# EAGLE schematic plug-board (EAGLE 6.5.0)
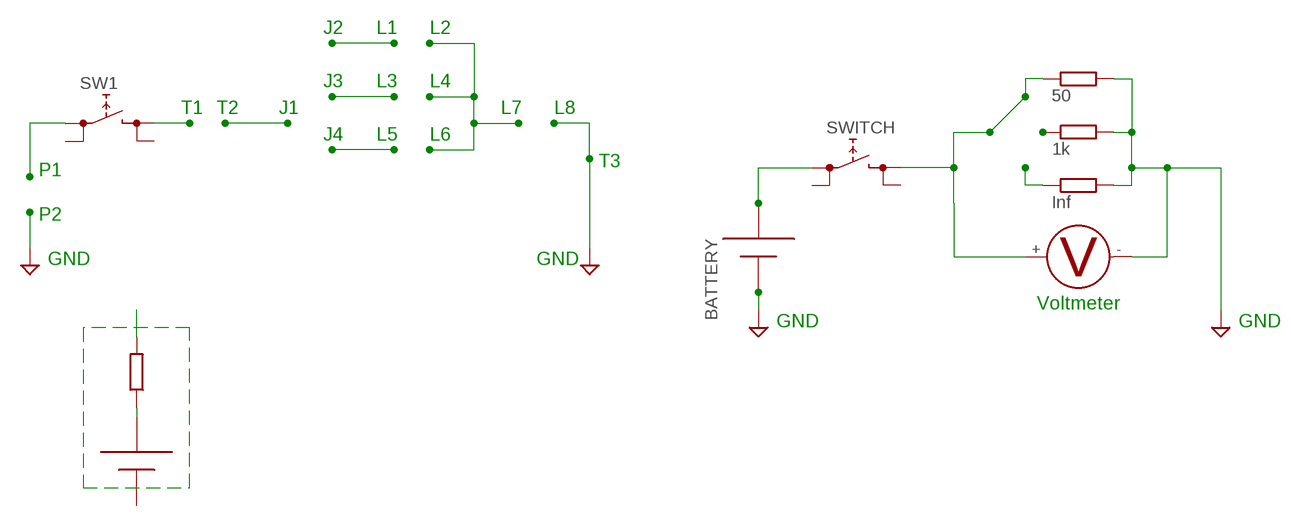
[diagram p0: schematic, sheet 1]

## Parts
BAT2  AAA  [12BH412]
BATTERY  AAA  [12BH412]
LOAD2  Inf  R-EU_0204/5  [0204/5]
LOAD3  1k  R-EU_0204/5  [0204/5]
LOAD4  50  R-EU_0204/5  [0204/5]
R0  R-EU_0204/5  [0204/5]
SW1  REKN  [REKN]
SWITCH  REKN  [REKN]
U$6  VOLTMETER  [METER]

## Nets
GND: BATTERY.+ LOAD2.2 LOAD3.2 LOAD4.2 U$6.-
N$1: SW1.0A
N$3: BAT2.- R0.1
N$4: SWITCH.1A U$6.+
N$5: R0.2
N$6: LOAD3.1
N$7: LOAD4.1
N$8: LOAD2.1
N$9: BATTERY.- SWITCH.0A
N$10: SW1.1A
Unconnected: BAT2.+ SW1.0B SW1.1B SWITCH.0B SWITCH.1B

## Notes on the sheet
- J2 | L1 | L2
- J3 | L3 | L4
- T1 | T2 | J1 | L7 | L8
- J4 | L5 | L6
- T3
- P1
- P2
- GND | GND
- Voltmeter
- GND | GND

## Library data of the parts
BAT2 BATTERY = adafruit:AAA: AAA PC pin holder Mouser part #12BH412 - but pretty much any 1x AAA battery holder should be the same http://www.ladyada.net/library/pcb/eaglelibrary.html
LOAD2-LOAD4 R0 = rcl:R-EU_: RESISTOR, European symbol
SW1 SWITCH = switch:REKN: PUSH SWITCH ITT-Cannon-Cannon
U$6 = My Library:VOLTMETER